# Altium schematic sheet Drone_esp32-S3.SchDoc
size A2; SheetNumber: 1; SheetTotal: 1
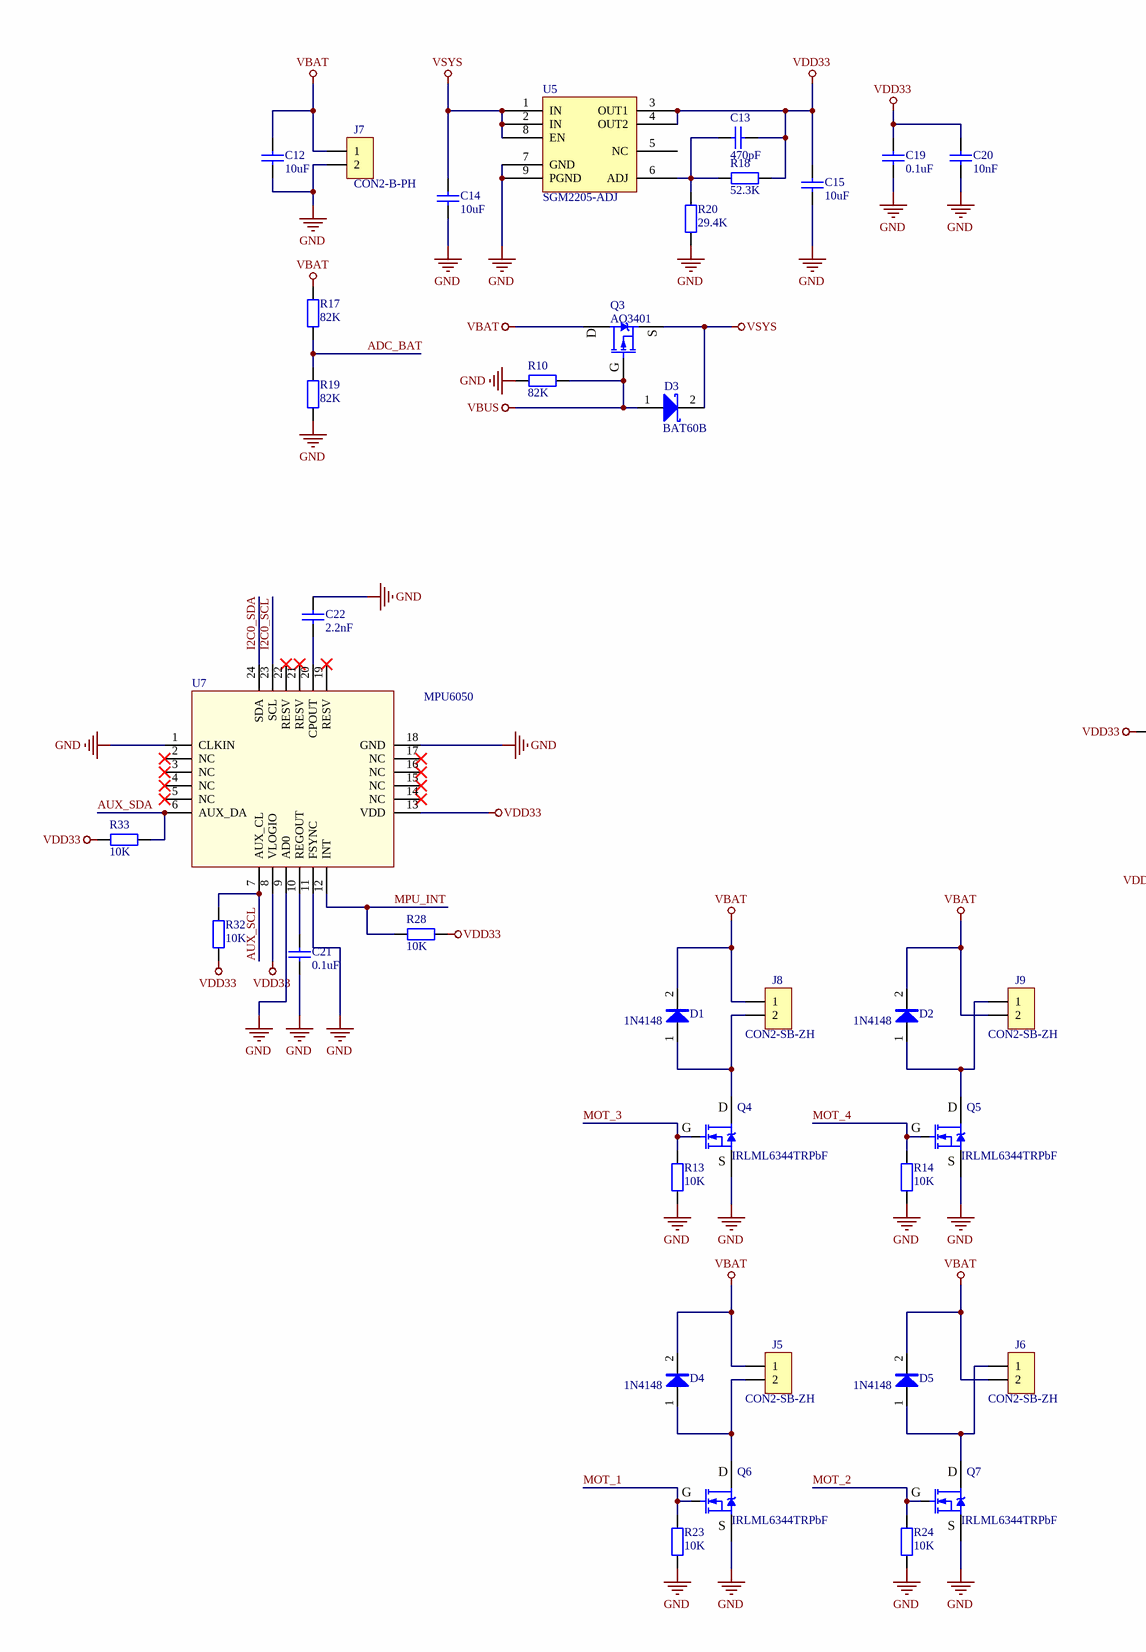
[diagram p0: Drone_esp32-S3.SchDoc, left]
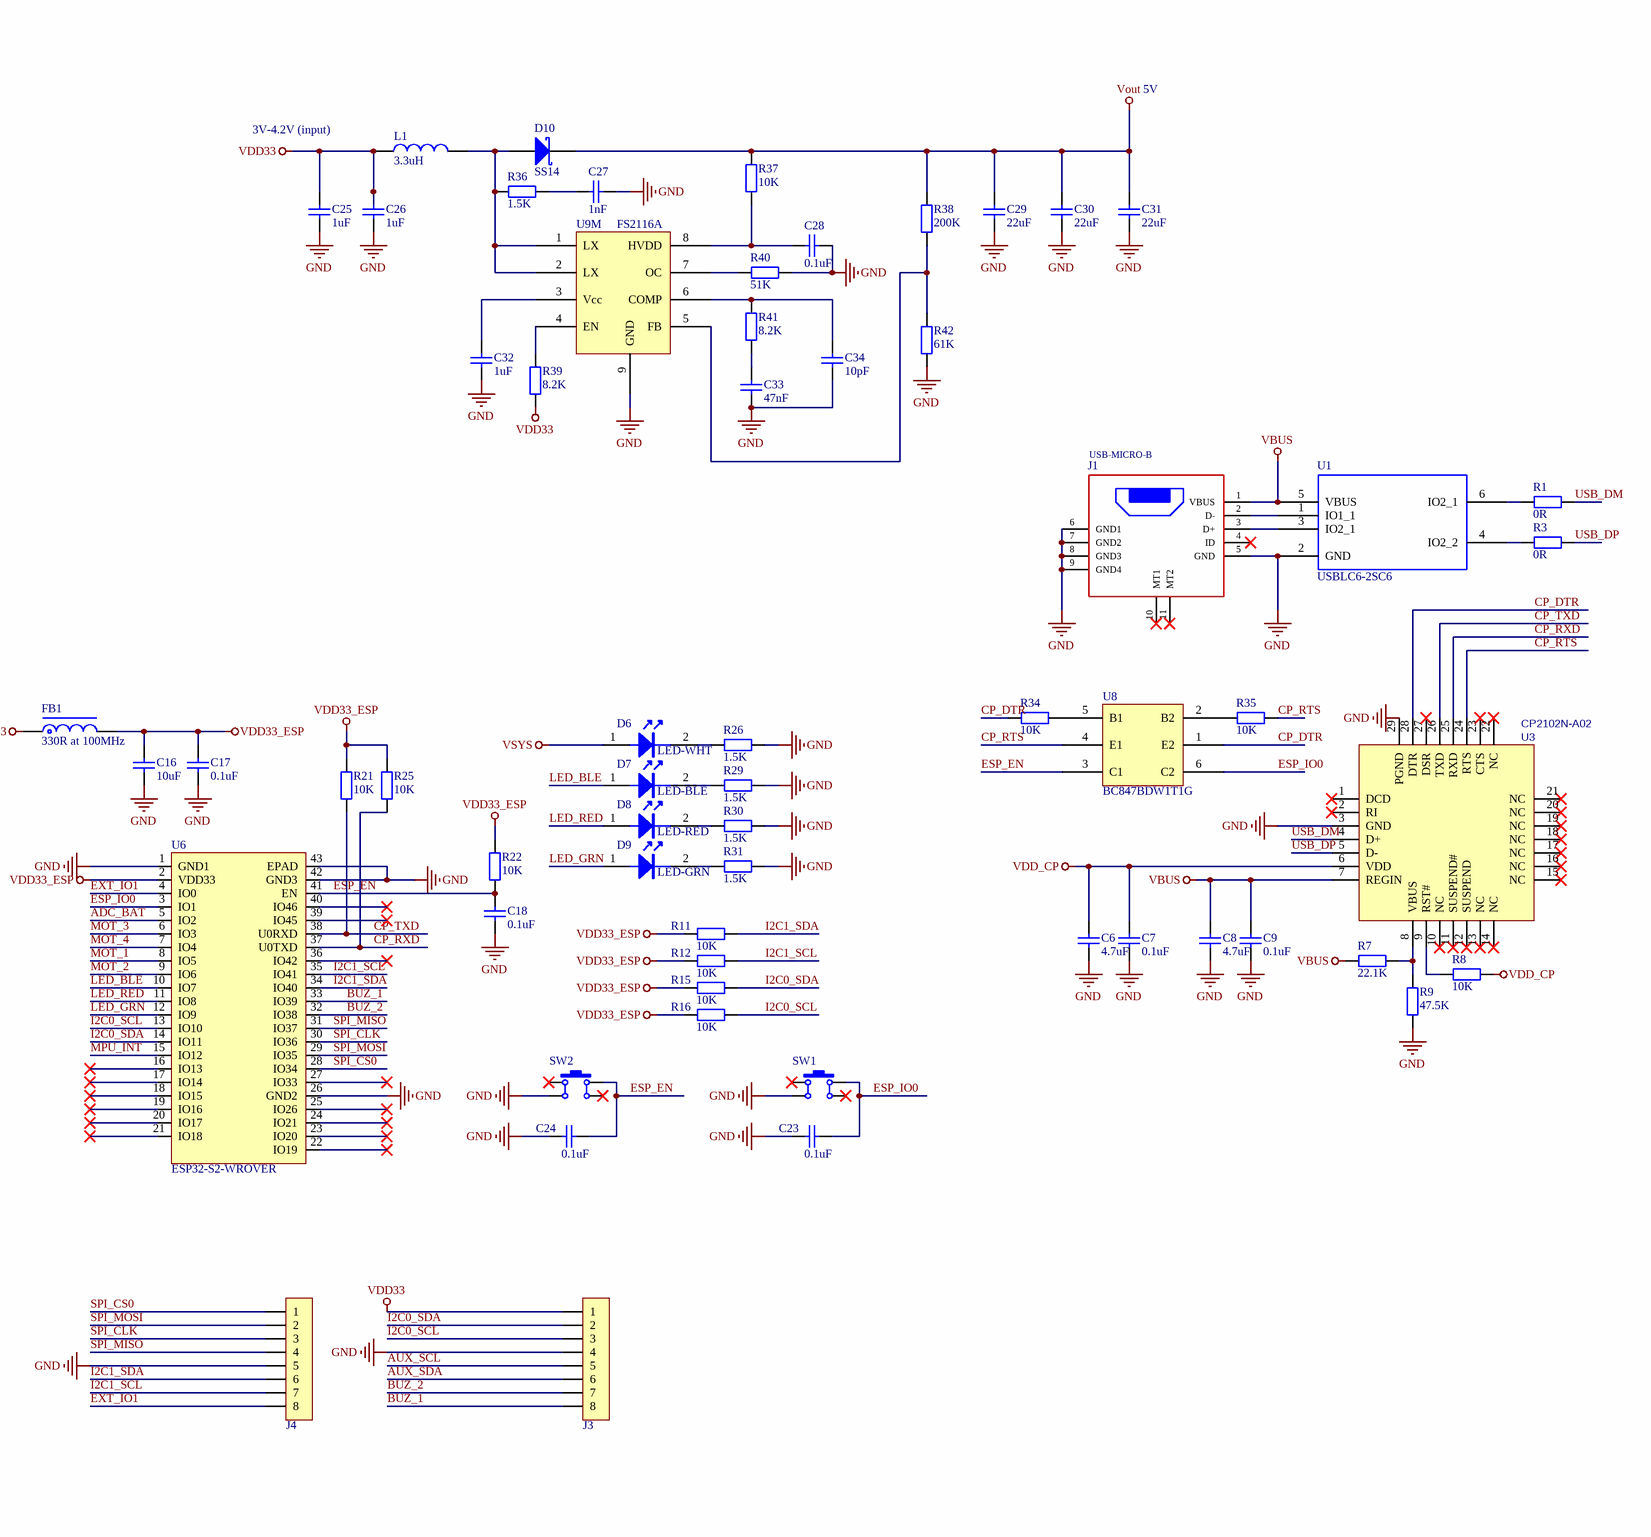
[diagram p1: Drone_esp32-S3.SchDoc, right]

## Parts
C6  4.7uF  [C0603_L]
C7  0.1uF  [C0402_L]
C8  4.7uF  [C0603_L]
C9  0.1uF  [C0402_L]
C12  10uF  [C0603_L]
C13  470pF  [C0402_L]
C14  10uF  [C0603_L]
C15  10uF  [C0603_L]
C16  10uF  [C0603_L]
C17  0.1uF  [C0402_L]
C18  0.1uF  [C0402_L]
C19  0.1uF  [C0402_L]
C20  10nF  [C0402_L]
C21  0.1uF  [C0402_L]
C22  2.2nF  [C0402_L]
C23  0.1uF  [C0402_L]
C24  0.1uF  [C0402_L]
C25  1uF  [C0603_L]
C26  1uF  [C0603_L]
C27  1nF  [C0603_L]
C28  0.1uF  [C0402_L]
C29  22uF  [C0603_L]
C30  22uF  [C0603_L]
C31  22uF  [C0603_L]
C32  1uF  [C0402_L]
C33  47nF  [C0603_L]
C34  10pF  [C0402_L]
D1  1N4148  [SOD-523]
D2  1N4148  [SOD-523]
D3  BAT60B  [SOD-323]
D4  1N4148  [SOD-523]
D5  1N4148  [SOD-523]
D6  LED-WHT  [LED3010-S]
D7  LED-BLE  [LED3010-S]
D8  LED-RED  [LED3010-S]
D9  LED-GRN  [LED3010-S]
D10  SS14  [SMA]
FB1  330R at 100MHz  [L0603]
J1  USB-MICRO-B  [USB2.0_MICRO-B_5]
J3  HDR-1X8  [A2005HWV-S-XP-A]  (value not drawn)
J4  HDR-1X8  [A2005HWV-S-XP-A]  (value not drawn)
J5  CON2-SB-ZH  [CON2X1_1P5_SMT_ZH-2A_DIP]
J6  CON2-SB-ZH  [CON2X1_1P5_SMT_ZH-2A_DIP]
J7  CON2-B-PH  [CON2X1]
J8  CON2-SB-ZH  [CON2X1_1P5_SMT_ZH-2A_DIP]
J9  CON2-SB-ZH  [CON2X1_1P5_SMT_ZH-2A_DIP]
L1  3.3uH  [L0805]
Q3  AO3401  [SOT-23-3]
Q4  IRLML6344TRPbF  [SOT-23-3]
Q5  IRLML6344TRPbF  [SOT-23-3]
Q6  IRLML6344TRPbF  [SOT-23-3]
Q7  IRLML6344TRPbF  [SOT-23-3]
R1  0R  [R0402_M]
R3  0R  [R0402_M]
R7  22.1K  [R0402_M]
R8  10K  [R0402_M]
R9  47.5K  [R0402_M]
R10  82K  [R0402_M]
R11  10K  [R0402_M]
R12  10K  [R0402_M]
R13  10K  [R0402_M]
R14  10K  [R0402_M]
R15  10K  [R0402_M]
R16  10K  [R0402_M]
R17  82K  [R0402_M]
R18  52.3K  [R0402_M]
R19  82K  [R0402_M]
R20  29.4K  [R0402_M]
R21  10K  [R0402_M]
R22  10K  [R0402_M]
R23  10K  [R0402_M]
R24  10K  [R0402_M]
R25  10K  [R0402_M]
R26  1.5K  [R0402_M]
R28  10K  [R0402_M]
R29  1.5K  [R0402_M]
R30  1.5K  [R0402_M]
R31  1.5K  [R0402_M]
R32  10K  [R0402_M]
R33  10K  [R0402_M]
R34  10K  [R0402_M]
R35  10K  [R0402_M]
R36  1.5K  [R0402_M]
R37  10K  [R0402_M]
R38  200K  [R0402_M]
R39  8.2K  [R0402_M]
R40  51K  [R0402_M]
R41  8.2K  [R0402_M]
R42  61K  [R0402_M]
SW1  6x6x5  [SW-SMD-3.5*3.0_4P]  (value not drawn)
SW2  6x6x5  [SW-SMD-3.5*3.0_4P]  (value not drawn)
U1  USBLC6-2SC6  [USBLC6-2SC6]
U3  CP2102N-A02  [FP-CP2102N-A02-GQFN28-MFG]
U5  SGM2205-ADJ  [SMG2205-ADJ]
U6  ESP32-S2-WROVER  [ESP32-S2-WROVER]
U7  MPU6050  [QFN24 4x4_L]
U8  BC847BDW1T1G  [ONSC-SOT-363-6-419B-02_W_V]
U9  FS2116A  [PCBComponent_1]  (part M of 13)

## Nets
GND: C6.1 C7.1 C8.1 C9.1 C12.1 C14.1 C15.1 C16.1 C17.1 C18.1 C19.1 C20.1 C21.1 C22.2 C23.1 C24.1 C25.1 C26.1 C27.2 C28.2 C29.1 C30.1 C31.1 C32.1 C33.1 C34.1 J1.5(GND) J1.6(GND1) J1.7(GND2) J1.8(GND3) J1.9(GND4) J3.4 J4.5 J7.2 Q4.2(S) Q5.2(S) Q6.2(S) Q7.2(S) R9.1 R10.1 R13.1 R14.1 R19.1 R20.1 R23.1 R24.1 R26.2 R29.2 R30.2 R31.2 R40.1 R42.1 SW1.4 SW2.4 U1.2(GND) U3.3(GND) U3.29(PGND) U5.7(GND) U5.9(PGND) U6.1(GND1) U6.26(GND2) U6.42(GND3) U6.43(EPAD) U7.1(CLKIN) U7.9(AD0) U7.11(FSYNC) U7.18(GND) U9.9(GND)
VBAT: C12.2 D1.2(K) D2.2(K) D4.2(K) D5.2(K) J5.1 J6.2 J7.1 J8.1 J9.2 Q3.3(D) R17.2
VBUS: C8.2 C9.2 D3.1(A) J1.1(VBUS) Q3.1(G) R7.1 R10.2 U1.5(VBUS) U3.7(REGIN)
VDD33: C13.2 C15.2 C19.2 C20.2 C25.2 C26.2 FB1.1 J3.1 L1.1 R18.2 R28.2 R32.1 R33.1 R39.1 U5.3(OUT1) U5.4(OUT2) U7.8(VLOGIO) U7.13(VDD)
VDD33_ESP: C16.2 C17.2 FB1.2 R11.1 R12.1 R15.1 R16.1 R21.2 R22.2 R25.2 U6.2(VDD33)
VDD_CP: C6.2 C7.2 R8.2 U3.6(VDD)
Vout: C29.2 C30.2 C31.2 D10.2(K) R37.2 R38.2
VSYS: C14.2 D3.2(K) D6.1 Q3.2(S) U5.1(IN) U5.2(IN) U5.8(EN)
ADC_BAT: R17.1 R19.2 U6.5(IO2)
AUX_SCL: J3.5 R32.2 U7.7(AUX_CL)
AUX_SDA: J3.6 R33.2 U7.6(AUX_DA)
BUZ_1: J3.8 U6.33(IO39)
BUZ_2: J3.7 U6.32(IO38)
CP_DTR: R34.1 U3.28(DTR) U8.1(E2)
CP_RTS: R35.2 U3.24(RTS) U8.4(E1)
CP_RXD: R25.1 U3.25(RXD) U6.37(U0TXD)
CP_TXD: R21.1 U3.26(TXD) U6.38(U0RXD)
ESP_EN: C18.2 C24.2 R22.1 SW2.2 U6.41(EN) U8.3(C1)
ESP_IO0: C23.2 SW1.2 U6.3(IO1) U8.6(C2)
EXT_IO1: J4.8 U6.4(IO0)
I2C0_SCL: J3.3 R16.2 U6.13(IO10) U7.23(SCL)
I2C0_SDA: J3.2 R15.2 U6.14(IO11) U7.24(SDA)
I2C1_SCL: J4.7 R12.2 U6.35(IO41)
I2C1_SDA: J4.6 R11.2 U6.34(IO40)
LED_BLE: D7.1 U6.10(IO7)
LED_GRN: D9.1 U6.12(IO9)
LED_RED: D8.1 U6.11(IO8)
MOT_1: Q6.1(G) R23.2 U6.8(IO5)
MOT_2: Q7.1(G) R24.2 U6.9(IO6)
MOT_3: Q4.1(G) R13.2 U6.6(IO3)
MOT_4: Q5.1(G) R14.2 U6.7(IO4)
MPU_INT: R28.1 U6.15(IO12) U7.12(INT)
SPI_CLK: J4.3 U6.30(IO36)
SPI_CS0: J4.1 U6.28(IO34)
SPI_MISO: J4.4 U6.31(IO37)
SPI_MOSI: J4.2 U6.29(IO35)
USB_DM: R1.2 U3.4(D+)
USB_DP: R3.2 U3.5(D-)
NetC13_1: C13.1 R18.1 R20.2 U5.6(ADJ)
NetC21_2: C21.2 U7.10(REGOUT)
NetC22_1: C22.1 U7.20(CPOUT)
NetC27_1: C27.1 R36.2
NetC28_1: C28.1 R37.1 U9.8(HVDD)
NetC32_2: C32.2 U9.3(Vcc)
NetC33_2: C33.2 R41.1
NetC34_2: C34.2 R41.2 U9.6(COMP)
NetD1_1: D1.1(A) J8.2 Q4.3(D)
NetD2_1: D2.1(A) J9.1 Q5.3(D)
NetD4_1: D4.1(A) J5.2 Q6.3(D)
NetD5_1: D5.1(A) J6.1 Q7.3(D)
NetD6_2: D6.2 R26.1
NetD7_2: D7.2 R29.1
NetD8_2: D8.2 R30.1
NetD9_2: D9.2 R31.1
NetD10_1: D10.1(A) L1.2 R36.1 U9.1(LX) U9.2(LX)
NetJ1_2: J1.2(D-) U1.1(IO1_1)
NetJ1_3: J1.3(D+) U1.3(IO2_1)
NetR1_1: R1.1 U1.6(IO2_1)
NetR3_1: R3.1 U1.4(IO2_2)
NetR7_2: R7.2 R9.2 U3.8(VBUS)
NetR8_1: R8.1 U3.9(RST#)
NetR34_2: R34.2 U8.5(B1)
NetR35_1: R35.1 U8.2(B2)
NetR38_1: R38.1 R42.2 U9.5(FB)
NetR39_2: R39.2 U9.4(EN)
NetR40_2: R40.2 U9.7(OC)

Not connected (* = marked no-connect by the designer): J1 4(ID)* 10(MT1)* 11(MT2)*; SW1 1* 3*; SW2 1* 3*; U3 1(DCD)* 2(RI)* 10(NC)* 11(SUSPEND#)* 12(SUSPEND)* 13(NC)* 14(NC)* 15(NC)* 16(NC)* 17(NC)* 18(NC)* 19(NC)* 20(NC)* 21(NC)* 22(NC)* 23(CTS)* 27(DSR)*; U5 5(NC); U6 16(IO13)* 17(IO14)* 18(IO15)* 19(IO16)* 20(IO17)* 21(IO18)* 22(IO19)* 23(IO20)* 24(IO21)* 25(IO26)* 27(IO33)* 36(IO42)* 39(IO45)* 40(IO46)*; U7 2(NC)* 3(NC)* 4(NC)* 5(NC)* 14(NC)* 15(NC)* 16(NC)* 17(NC)* 19(RESV)* 21(RESV)* 22(RESV)*

## Notes on the sheet
- 5V
- 3V-4.2V (input)

## Library data of the parts
C6-C9 C12-C34 = C: 贴片电容/MLCC电容; BOM名称: 无极性贴片电容; 联系下单店铺卖家 免费帮你查找封装: 联系下单店铺卖家 免费技术指导
D1 D2 D4 D5 = 1N4148: 开关二极管; BOM名称: 高速开关二极管; 当前库版本V2024.5.31，下一版本发布时间2024年8月份 @淘宝卖家:黄晶宝石: 最新版本发布网址https://item.taobao.com/item.htm?id=566775463719
D3 = D-Schottky: 肖特基二极管; 当前库版本V2024.5.31，下一版本发布时间2024年8月份 @淘宝卖家:黄晶宝石: 最新版本发布网址https://item.taobao.com/item.htm?id=566775463719
D6-D9 = 发光二极管: LED; 当前库版本V2024.5.31，下一版本发布时间2024年8月份 @淘宝卖家:黄晶宝石: 最新版本发布网址https://item.taobao.com/item.htm?id=566775463719
D10 = SS14: 肖特基二极管; 属性: 40V/1A; 当前库版本V2024.5.31，下一版本发布时间2024年8月份 @淘宝卖家:黄晶宝石: 最新版本发布网址https://item.taobao.com/item.htm?id=566775463719; BOM名称: 肖特基二极管
FB1 = FB: 贴片磁珠; BOM名称: 直插磁珠; 联系下单店铺卖家 免费帮你查找封装: 联系下单店铺卖家 免费技术指导
J1 = USB3.1_Micro-B: USB3.1_Micro-B母座; 当前库版本V2024.5.31，下一版本发布时间2024年8月份 @淘宝卖家:黄晶宝石: 最新版本发布网址https://item.taobao.com/item.htm?id=566775463719
J3 J4 = Header 8: 8P接插件; 封装库来自淘宝卖家：黄晶宝石: 获取最新版本https://shop463601444.taobao.com; 联系下单店铺卖家 免费帮你查找封装: 联系下单店铺卖家 免费技术支持
J5-J9 = Header 2: 2P接插件; 封装库来自淘宝卖家：黄晶宝石: 获取最新版本https://shop463601444.taobao.com; 联系下单店铺卖家 免费帮你查找封装: 联系下单店铺卖家 免费技术支持; BOM名称: 2P接插件
L1 = L: 贴片小功率电感; BOM名称: 小功率贴片电感; 联系下单店铺卖家 免费帮你查找封装: 联系下单店铺卖家 免费技术指导
Q3 = AO3401: P沟道 30V/4.2A; BOM名称: 场效应管; 联系下单店铺卖家 免费帮你查找封装: 联系下单店铺卖家 免费技术支持; 当前库版本V2024.2.3 @淘宝卖家:黄晶宝石: 最新版本发布https://item.taobao.com/item.htm?id=566775463719; 参数: P沟道 30V/4.2A
Q4-Q7 = SI2302: BOM名称: N沟道场效应管; 联系下单店铺卖家 免费帮你查找封装: 联系下单店铺卖家 免费技术支持; 当前库版本V2024.2.3 @淘宝卖家:黄晶宝石: 最新版本发布https://item.taobao.com/item.htm?id=566775463719
R1 R3 R7-R26 R28-R42 = R: 贴片电阻; 联系下单店铺卖家 免费帮你查找封装: 联系下单店铺卖家 免费技术指导; BOM名称: 贴片电阻
SW1 SW2 = SW-PB4: 4脚微动开关; BOM名称: 直插6x6轻触开关; 联系下单店铺卖家 免费技术支持: 联系下单店铺卖家 免费帮你查找封装
U3 = CP2102-GMR: USB转UART 桥接控制器; 封装库来自淘宝卖家：黄晶宝石: 其他店铺购入均为盗版封装库，无更新权益，请立即申请退款，联系卖家：黄晶宝石 获取现金奖励200~5000元
U5 = SGM2205-ADJ: Vout=1.2(1+Ra/Rb)=3.3V
U6 = ESP32-S2
U7 = MPU6050: 三轴加速度+三轴陀螺仪; 封装库来自淘宝卖家：黄晶宝石: 其他店铺购入均为盗版封装库，无售后更新权益，请立即申请退款，退款现金奖励200~1000元; BOM名称: MPU6050
U8 = CMP-013-00036-4: ON Semi BC847BDW1T1G Dual NPN Bipolar Transistor; 0.1 A; 45 V; 6-Pin SC-88; Frequency: 100MHz; Case/Package: SOT-363-6; Max Operating Temperature: 150°C; Min Operating Temperature: -55°C; Pins: 6